# Altium schematic sheet Buck Boost Converter.SchDoc: Buck Boost Converter
size A4; SheetNumber: 6; SheetTotal: 37
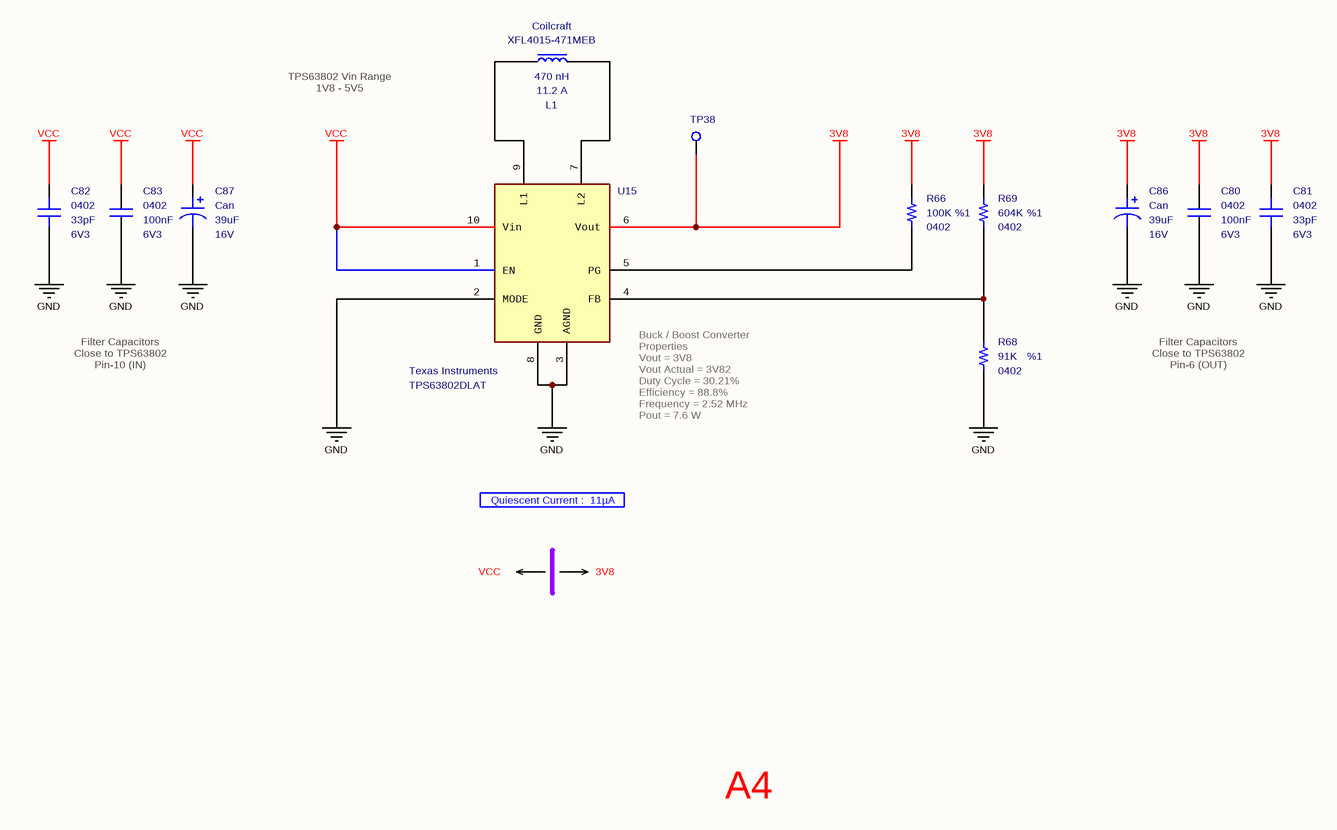
[diagram p0: Buck Boost Converter.SchDoc]

## Parts
C80  value 100nF  Case: 0402  Voltage: 6V3  [CAPACITOR_0402]  (hidden comment: Multilayer Ceramic Capacitor)
C81  value 33pF  Case: 0402  Voltage: 6V3  [CAPACITOR_0402]  (hidden comment: Multilayer Ceramic Capacitor)
C82  value 33pF  Case: 0402  Voltage: 6V3  [CAPACITOR_0402]  (hidden comment: Multilayer Ceramic Capacitor)
C83  value 100nF  Case: 0402  Voltage: 6V3  [CAPACITOR_0402]  (hidden comment: Multilayer Ceramic Capacitor)
C86  value 39uF  Case: Can  Voltage: 16V  [CAPACITOR_CAN-B6]  (hidden comment: Aluminium Organic Polymer Capacitors)
C87  value 39uF  Case: Can  Voltage: 16V  [CAPACITOR_CAN-B6]  (hidden comment: Aluminium Organic Polymer Capacitors)
L1  value 470 nH  Maximum DC Current: 11.2 A  Manufacturer_Part_Number: XFL4015-471MEB  Manufacturer_Name: Coilcraft  [INDUCTOR_XFL4015]  (hidden comment: Fixed Inductor)
R66  value 100K  Tolerance: %1  Case: 0402  [RESISTOR_0402]  (hidden comment: Thick Film Resistor)
R68  value 91K  Tolerance: %1  Case: 0402  [RESISTOR_0402]  (hidden comment: Thick Film Resistor)
R69  value 604K  Tolerance: %1  Case: 0402  [RESISTOR_0402]  (hidden comment: Thick Film Resistor)
TP38  PCB - Test Point  [Test_Pad - Hole]  (value not drawn)  (no BOM)
U15  Manufacturer_Part_Number: TPS63802DLAT  Manufacturer_Name: Texas Instruments  [VSON-10]  (hidden comment: Buck-Boost Converter)

## Nets
3V8: C80.1 C81.2 C86.1 R66.2 R69.2 TP38.1 U15.6(Vout)
GND: C80.2 C81.1 C82.1 C83.2 C86.2 C87.2 R68.1 U15.2(MODE) U15.3(AGND) U15.8(GND)
VCC: C82.2 C83.1 C87.1 U15.1(EN) U15.10(Vin)
NetL1_1: L1.1 U15.9(L1)
NetL1_2: L1.2 U15.7(L2)
NetR66_1: R66.1 U15.5(PG)
NetR68_2: R68.2 R69.1 U15.4(FB)

## Notes on the sheet
- TPS63802 Vin Range
  1V8 - 5V5
- Filter Capacitors
  Close to TPS63802
  Pin-10 (IN)
- Filter Capacitors
  Close to TPS63802
  Pin-6 (OUT)
- (near U15) Buck / Boost Converter Properties
  Vout = 3V8
  Vout Actual = 3V82
  Duty Cycle = 30.21%
  Efficiency = 88.8%
  Frequency = 2.52 MHz
  Pout = 7.6 W
- Quiescent Current :  11µA
- VCC
- 3V8
- A4
- Title
- Size:
- Date:
- Number:
- Time:
- Revision:
- Sheet
- of
- File:

## Library data of the parts
C80 C83 = Capacitor - 100nF [0402-6V3]: Capacitor - 100nF [0402-6V3] (Ceramic); Manufacturer_Name: AVX; Manufacturer_Part_Number: 04026D104KAT4A; Dielectric: X5R; Tolerance: %10; Height: 0.25mm; Mouser_Part_Number: 581-04026D104KAT4A; ComponentLink1Description: Mouser; ComponentLink1URL: https://www.mouser.com.tr/ProductDetail/AVX/04026D104KAT4A?qs=sGAEpiMZZMs0AnBnWHyRQPg4iYkCw7IMED%2F4kpqgf7w%3D; ComponentLink2Description: DataSheet; ComponentLink2URL: https://www.mouser.com.tr/datasheet/2/40/cx5r-776519.pdf; ROHS: Yes; Maximum Operating Temperature: +85; Minimum Operating Temperature: -55; Supplier 1: Avnet; Supplier Part Number 1: 04026D104KAT4A
C81 C82 = Capacitor - 33pF [0402-6V3]: Capacitor - 33pF [0402] (Ceramic); Manufacturer_Name: Kemet; Manufacturer_Part_Number: C0402C330J9RACAUTO; Dielectric: X7R; Tolerance: 10%; Height: 0.5mm; Mouser_Part_Number: 80-C0402C330J9RAUTO; Maximum Operating Temperature: +125; Minimum Operating Temperature: -55; ROHS: Yes; ComponentLink1Description: DataSheet; ComponentLink1URL: https://api.kemet.com/component-edge/download/datasheet/C0402C330J9RACAUTO.pdf; ComponentLink2Description: Mouser; ComponentLink2URL: https://www.mouser.com/Search/Refine.aspx?Keyword=80-C0402C330J9RAUTO; Supplier 1: Mouser; Supplier Part Number 1: 80-C0402C330J9RAUTO
C86 C87 = Capacitor - 39uF [Can-16V]: Capacitor - 39uF 16V [Can] (Electrolytic); Manufacturer_Name: Panasonic; Manufacturer_Part_Number: 16SVPC39MV; Leakage Current: 300uA; Tolerance: 20%; ESR: 27 mOhms; Height: 6mm; Mouser_Part_Number: 667-16SVPC39MV; Maximum Operating Temperature: +105; Minimum Operating Temperature: -55; ROHS: Yes; ComponentLink1Description: DataSheet; ComponentLink1URL: https://www.mouser.com.tr/datasheet/2/315/SVPC_OS-1197065.pdf; ComponentLink2Description: Mouser; ComponentLink2URL: https://www.mouser.com.tr/ProductDetail/Panasonic/16SVPC39MV?qs=%2Fha2pyFadujpu3ATUg5hwJ6EWbTfmGGWJDu5kzoHUqwaZzNIr7t5GA%3D%3D; Supplier 1: Mouser; Supplier 2: Digi-Key; Supplier Part Number 2: P16473CT-ND; Supplier Part Number 1: 667-16SVPC39MV
L1 = Inductor - 470 nH [SMD]: Fixed Inductors 0.47uH 20% 11.2A 8.36mOhms AEC-Q200; Height: 1.6mm; Mouser_Part_Number: 994-XFL4015-471MEB; ComponentLink1Description: DataSheet; ComponentLink1URL: https://eu.mouser.com/datasheet/2/597/xfl4015-270755.pdf; ComponentLink2Description: Mouser; ComponentLink2URL: https://eu.mouser.com/ProductDetail/Coilcraft/XFL4015-471MEB?qs=VJjuEbE9QBO6UaDdUAgr%252Bw%3D%3D; Maximum DC Resistance: 8.36 mOhms; Maximum Operating Temperature: +125; Minimum Operating Temperature: -40; Tolerance: 20%; Supplier 1: Mouser; Supplier 2: Farnell; Supplier 3: Digi-Key; Supplier 4: Newark; Supplier Part Number 1: 710-7443551130; Supplier Part Number 2: 1869775; Supplier Part Number 4: 32T8562; Supplier Part Number 3: 732-1124-1-ND; Case: XFL4015
R66 = Resistor - 100K: Thick Film Resistors - SMD 1/16 W 100 Kohms 1%; Manufacturer_Name: Vishay; Manufacturer_Part_Number: CRCW0402100KFKED; Height: 0.35mm; Mouser_Part_Number: 71-CRCW0402-100K-E3; ComponentLink1Description: DataSheet; ComponentLink1URL: https://www.mouser.com.tr/datasheet/2/427/dcrcwe3-1762152.pdf; ComponentLink2Description: Mouser; ComponentLink2URL: https://eu.mouser.com/ProductDetail/Vishay-Dale/CRCW0402100KFKED?qs=OlqPY1CiralZGKRwQ4Glcg%3D%3D; Supplier 1: Future Electronics; Supplier 2: Future Electronics; Supplier 3: Arrow; Supplier 4: Farnell; Supplier 5: Digi-Key; Supplier Part Number 1: CRCW0402100KFKED-CUTT; Supplier Part Number 2: CRCW0402100KFKED-REEL; Supplier Part Number 3: CRCW0402100KFKED; Supplier Part Number 4: 2121857; Supplier Part Number 5: 541-100KLCT-ND
R68 = Resistor - 91K: Thick Film Resistors - SMD 1/16 W 91 Kohms 1%; Manufacturer_Name: Vishay; Manufacturer_Part_Number: CRCW040291K0FKED; Height: 0.35mm; Mouser_Part_Number: 71-CRCW040291K0FKED; ComponentLink1Description: DataSheet; ComponentLink1URL: https://eu.mouser.com/datasheet/2/427/dcrcwe3-1762152.pdf; ComponentLink2Description: Mouser; ComponentLink2URL: https://eu.mouser.com/ProductDetail/Vishay-Dale/CRCW040291K0FKED?qs=Po1ctqG%2F82oNfd9H7rZeFQ%3D%3D; Supplier 1: Future Electronics; Supplier 2: Arrow; Supplier 3: Farnell; Supplier 4: Newark; Supplier 5: Digi-Key; Supplier Part Number 1: CRCW040291K0FKED-REEL; Supplier Part Number 2: CRCW040291K0FKED; Supplier Part Number 3: 2121853; Supplier Part Number 4: 24W2519; Supplier Part Number 5: 541-91.0KLCT-ND
R69 = Resistor - 604K: Thick Film Resistors - SMD 1/16 W 604 Kohms 1%; Manufacturer_Name: Vishay; Manufacturer_Part_Number: CRCW0402604KFKED; Height: 0.35mm; Mouser_Part_Number: 71-CRCW0402-604K-E3; ComponentLink1Description: DataSheet; ComponentLink1URL: https://eu.mouser.com/datasheet/2/427/dcrcwe3-1762152.pdf; ComponentLink2Description: Mouser; ComponentLink2URL: https://eu.mouser.com/ProductDetail/Vishay-Dale/CRCW0402604KFKED?qs=DKbL89i6OEpzv5ZGRZfINw%3D%3D; Supplier 1: Mouser; Supplier 2: Digi-Key; Supplier Part Number 1: 71-CRCW0402390KFKED; Supplier Part Number 2: 541-390KLCT-ND
TP38 = PCB - Test Point: Test Point
U15 = IC - TPS63802DLAT: Switching Voltage Regulators High current, high efficiency single inductor buck-boost converter 10-VSON-HR -40 to 125; Mouser_Part_Number: 595-TPS63802DLAT; ComponentLink1Description: DataSheet; ComponentLink1URL: https://www.mouser.com.tr/datasheet/2/256/MAX17055-1097125.pdf; ComponentLink2Description: Mouser; ComponentLink2URL: https://www.mouser.com.tr/ProductDetail/Maxim-Integrated/MAX17055ETB%2bT?qs=sGAEpiMZZMve4%2FbfQkoj%252BAs6FTSsQJaJrD7Z3v0Qe9M%3D; Minimum Operating Temperature: -40; Maximum Operating Temperature: +125; Supplier 1: Avnet; Supplier 2: Mouser; Supplier 3: Digi-Key; Supplier Part Number 1: TPS63802DLAT; Supplier Part Number 2: 595-TPS63802DLAT; Supplier Part Number 3: 296-TPS63802DLATCT-ND; Case: VSON-10